# Altium project IMU_level_shifter.PrjPCB
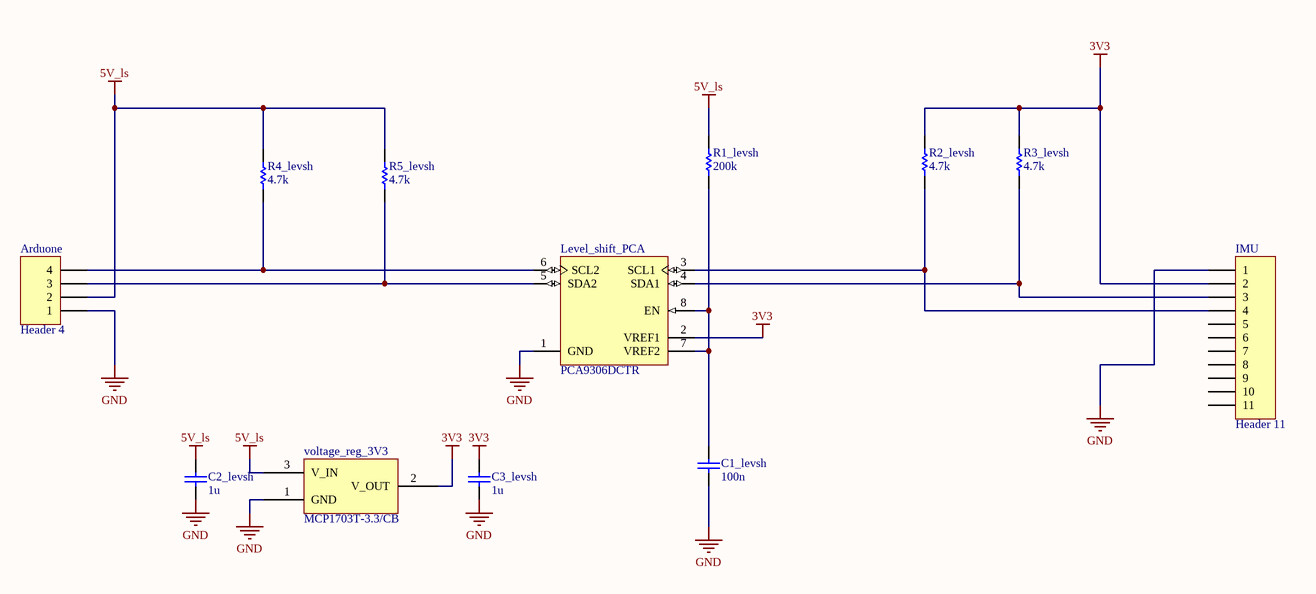
[diagram p0: IMU_level_shifter.SchDoc]
1 sheet, 12 parts. Net scope: global (net labels, ports and power ports of the same name join across sheets).
Board file: IMU_level_shifter_11_connectors.PcbDoc

## Sheet IMU_level_shifter.SchDoc
size A4; PageSetup: Record=PageOptions|CenterHorizontal=True|CenterVertical=True|PrintScale=0.71|XCorrection=1.00|YCorrection=1.00|PrintKind=1|BorderSize=5000000|LeftOffset=0|BottomOffset=0|Orientation=2|PaperLength=1000|PaperWidth=1000|Scale=100|PaperSource=7|PrintQuality=-4|MediaType=1|DitherType=10|PaperKind=A3 (297 x 420 mm)|PrintScaleMode=1; Organization: EPFL; DocumentNumber: 1; Revision: 1; SheetNumber: 1; SheetTotal: 1

### Parts
Arduone  Header 4  [HDR1X4]
C1_levsh  100n  [CAPC1608N]
C2_levsh  1u  [CAPC1608N]
C3_levsh  1u  [CAPC1608N]
IMU  Header 11  [HDR1X11]
Level_shift_PCA  PCA9306DCTR  [DCT8_N]
R1_levsh  200k  [RESC1608N]
R2_levsh  4.7k  [RESC1608N]
R3_levsh  4.7k  [RESC1608N]
R4_levsh  4.7k  [RESC1608N]
R5_levsh  4.7k  [RESC1608N]
voltage_reg_3V3  MCP1703T-3.3/CB  [SOT23-3N]

### Nets
3V3: C3_levsh.2 IMU.2 Level_shift_PCA.2(VREF1) R2_levsh.2 R3_levsh.2 voltage_reg_3V3.2(V_OUT)
5V_ls: Arduone.2 C2_levsh.2 R1_levsh.1 R4_levsh.2 R5_levsh.2 voltage_reg_3V3.3(V_IN)
GND: Arduone.1 C1_levsh.1 C2_levsh.1 C3_levsh.1 IMU.1 Level_shift_PCA.1(GND) voltage_reg_3V3.1(GND)
NetArduone_3: Arduone.3 Level_shift_PCA.5(SDA2) R5_levsh.1
NetArduone_4: Arduone.4 Level_shift_PCA.6(SCL2) R4_levsh.1
NetC1_levsh_2: C1_levsh.2 Level_shift_PCA.7(VREF2) Level_shift_PCA.8(EN) R1_levsh.2
NetIMU_3: IMU.3 Level_shift_PCA.4(SDA1) R3_levsh.1
NetIMU_4: IMU.4 Level_shift_PCA.3(SCL1) R2_levsh.1

Not connected (* = marked no-connect by the designer): IMU 5 6 7 8 9 10 11

### Notes on the sheet
- Title
- Size:
- Date:
- A4
- Number:
- Time:
- Revision:
- Sheet
- of
- File:

### Library data of the parts
Arduone = Header 4: Header, 4-Pin; LatestRevisionDate: 17-Jul-2002; LatestRevisionNote: Re-released for DXP Platform.; Publisher: Altium Limited
C1_levsh C2_levsh C3_levsh = Cap: Capacitor; Published: 8-Jun-2000; LatestRevisionDate: 17-Jul-2002; LatestRevisionNote: Re-released for DXP Platform.; PackageReference: RAD-0.3; Publisher: Altium Limited; PackageDescription: Radial Cap, Thru-Hole; 2 Leads; 0.3 in Pin Spacing
IMU = Header 11: Header, 11-Pin; LatestRevisionDate: 17-Jul-2002; LatestRevisionNote: Re-released for DXP Platform.; Publisher: Altium Limited
Level_shift_PCA = PCA9306DCTR: Dual Bi-Directional I2C-Bus and SMBus Voltage Level-Translator, 0 to 5.5 V, -40 to 85 degC, 8-pin SM8 (DCT), Green (RoHS & no Sb/Br); Manufacturer: Texas Instruments; SubFamily: I2C Special Function; No. of Outputs: 2; tpd max(ns): 1.5; fSCLK(Max)(MHz): 400; Function: Voltage Translator; Vcc range(V): 0 to 5.5; Enable Pin: Yes; Rating: Catalog; DatasheetVersion: SCPS113J; PackageVersion: revC, Sep-2002; PackageReference: DCT8; PackageDescription: 8-Pin Thin Small Outline Package 3 x 2.8 mm Body ,0.65 mm Pitch; Supplier 1: Digi-Key; Supplier Part Number 1: 296-18509-2-ND; Supplier 2: Digi-Key; Supplier Part Number 2: 296-18509-1-ND; Supplier 3: Digi-Key; Supplier Part Number 3: 296-18509-6-ND; Supplier 4: Farnell; Supplier Part Number 4: 1470936RL; Supplier 5: Farnell; Supplier Part Number 5: 1470936; Supplier 6: Newark; Supplier Part Number 6: 65J6232; Supplier 7: Mouser; Supplier Part Number 7: 595-PCA9306DCTR; Eco-Plan: Green (RoHS & no Sb/Br); Max Frequency(kHz): 400; Open Drain I/O Type: Yes; 5V Tolerant I/O: Yes; On-Chip Power-on-Reset: No; Mounting Technology: Surface Mount; PartNumber: PCA9306DCTR; Code_JEDEC: MO-187-DA; ComponentLink1Description: Datasheet; ComponentLink1URL: http://www.ti.com/general/docs/lit/getliterature.tsp?genericPartNumber=PCA9306&fileType=pdf; ComponentLink2Description: Package Specification; ComponentLink2URL: http://www.ti.com/litv/pdf/mpds049b
R1_levsh R2_levsh R3_levsh R4_levsh R5_levsh = Res1: Resistor; Published: 8-Jun-2000; LatestRevisionDate: 17-Jul-2002; LatestRevisionNote: Re-released for DXP Platform.; PackageReference: AXIAL-0.3; Publisher: Altium Limited; PackageDescription: Axial Device, Thru-Hole; 2 Leads; 0.3 in Pin Spacing
voltage_reg_3V3 = MCP1703T/CB: 250 mA, 16V, Low Quiescent Current LDO Regulator